# Altium schematic sheet Sheet.SchDoc
size A4; SheetNumber: 1; SheetTotal: 1
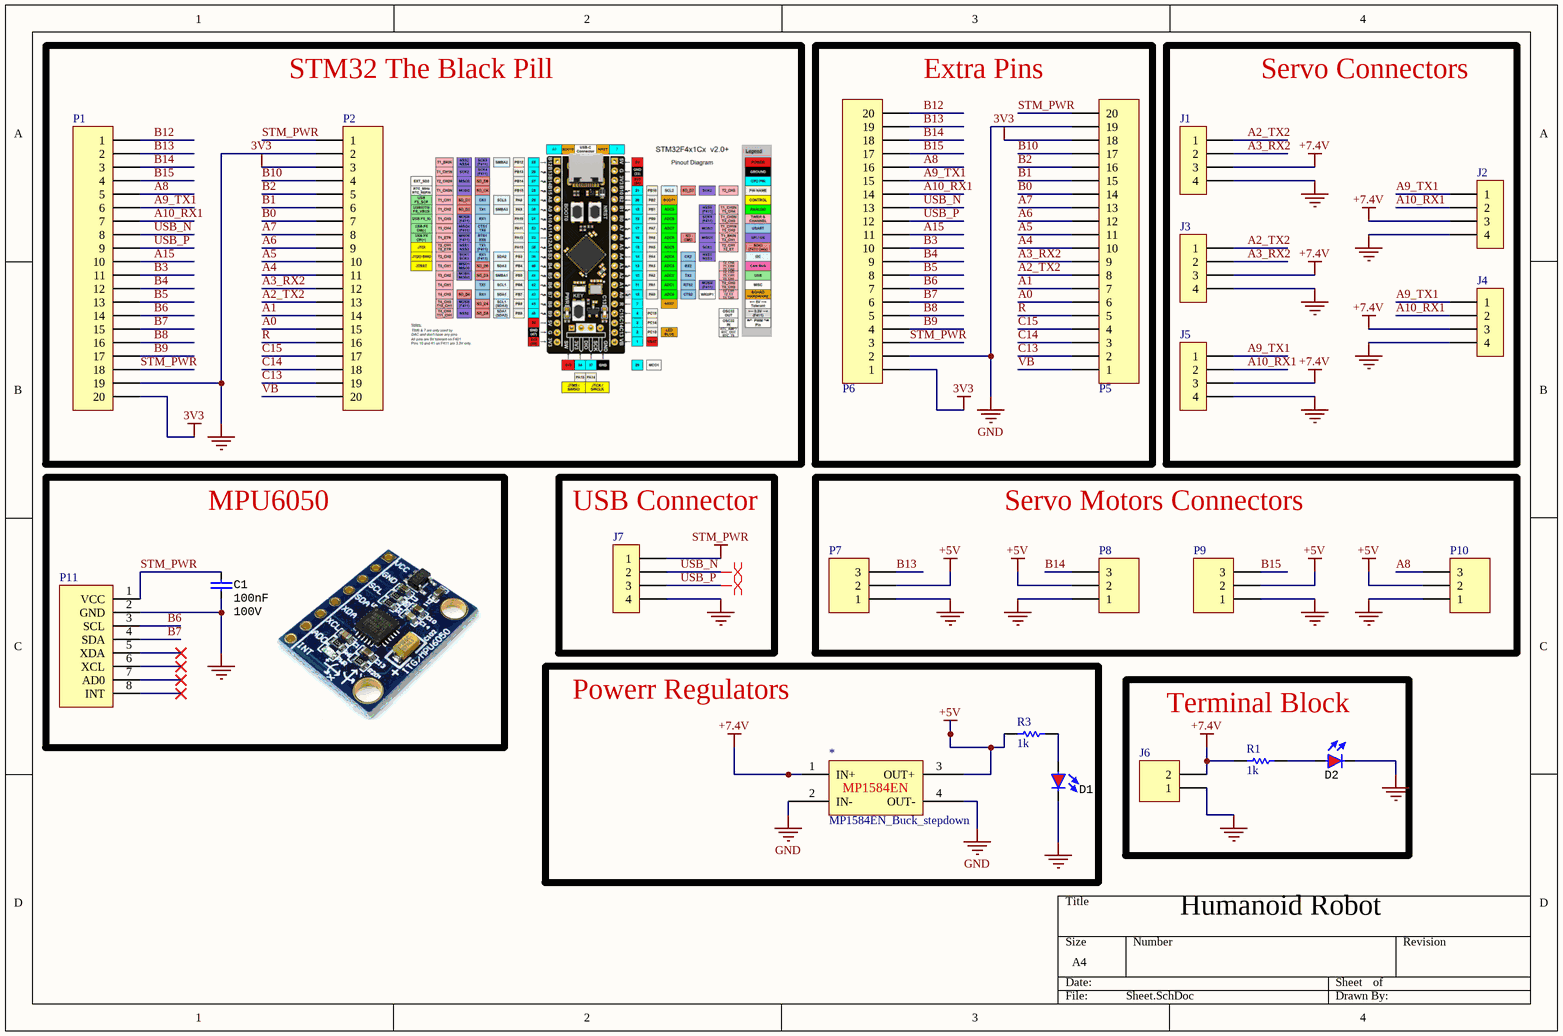
[diagram p0: Sheet.SchDoc]

## Parts
*  MP1584EN_Buck_stepdown  [MP1584EN_MODULE]
C1  value 100nF  Voltage: 100V  [CAP Ceramic SMD 0603]
D1  (no value)  [LED SMD 0805R]
D2  (no value)  [LED SMD 0805R]
J1  JST 4  [XH4/2.54mm/180]  (value not drawn)
J2  JST 4  [XH4/2.54mm/180]  (value not drawn)
J3  JST 4  [XH4/2.54mm/180]  (value not drawn)
J4  JST 4  [XH4/2.54mm/180]  (value not drawn)
J5  JST 4  [XH4/2.54mm/180]  (value not drawn)
J6  PWR IN  [Connector screw terminal Block TH 1x2 5.0]  (value not drawn)
J7  JST 4  [XH4/2.54mm/180]  (value not drawn)
P1  Connector Pinheader 1x20  [Header F 2.54X20]  (value not drawn)
P2  Connector Pinheader 1x20  [Header F 2.54X20]  (value not drawn)
P5  Connector Pinheader 1x20  [Header F 2.54X20]  (value not drawn)
P6  Connector Pinheader 1x20  [Header F 2.54X20]  (value not drawn)
P7  L_gripper  [Header 2.54X3]  (value not drawn)
P8  Connector Pinheader 1x3  [Header 2.54X3]  (value not drawn)
P9  R_gripper  [Header 2.54X3]  (value not drawn)
P10  Connector Pinheader 1x3  [Header 2.54X3]  (value not drawn)
P11  MPU6050 (GY-521 Module)  [MPU6050 (GY-521 Module)]  (value not drawn)
R1  value 1k  [RESC2013X70X40ML20T20]  (hidden comment: Resistor 1k +/-1% 0805 125 mW)
R3  value 1k  [RESC2013X70X40ML20T20]  (hidden comment: Resistor 1k +/-1% 0805 125 mW)

## Blocks framed on the sheet
STM32 The Black Pill: P1 P2
Extra Pins: P5 P6
Servo Connectors: J1-J5
MPU6050: C1 P11
USB Connector: J7
Servo Motors Connectors: P7-P10
Powerr Regulators: * D1 R3
Terminal Block: D2 J6 R1

## Nets
3V3: P1.20 P2.3 P5.18 P6.1
+5V: *.3(OUT+) P7.2 P8.2 P9.2 P10.2 R3.1
+7.4V: *.1(IN+) J1.3 J2.3 J3.3 J4.3 J5.3 J6.2 R1.1
GND: *.2(IN-) *.4(OUT-) C1.2 D1.2 D2.2 J1.4 J2.4 J3.4 J4.4 J5.4 J6.1 J7.4 P1.19 P2.2 P5.19 P6.2 P7.1 P8.1 P9.1 P10.1 P11.2(GND)
STM_PWR: C1.1 J7.1 P1.18 P2.1 P5.20 P6.3 P11.1(VCC)
A0: P2.15 P5.6
A1: P2.14 P5.7
A2_TX2: J1.1 J3.1 P2.13 P5.8
A3_RX2: J1.2 J3.2 P2.12 P5.9
A4: P2.11 P5.10
A5: P2.10 P5.11
A6: P2.9 P5.12
A7: P2.8 P5.13
A8: P1.5 P6.16 P10.3
A9_TX1: J2.1 J4.1 J5.1 P1.6 P6.15
A10_RX1: J2.2 J4.2 J5.2 P1.7 P6.14
A15: P1.10 P6.11
B0: P2.7 P5.14
B1: P2.6 P5.15
B2: P2.5 P5.16
B3: P1.11 P6.10
B4: P1.12 P6.9
B5: P1.13 P6.8
B6: P1.14 P6.7 P11.3(SCL)
B7: P1.15 P6.6 P11.4(SDA)
B8: P1.16 P6.5
B9: P1.17 P6.4
B10: P2.4 P5.17
B12: P1.1 P6.20
B13: P1.2 P6.19 P7.3
B14: P1.3 P6.18 P8.3
B15: P1.4 P6.17 P9.3
C13: P2.19 P5.2
C14: P2.18 P5.3
C15: P2.17 P5.4
R: P2.16 P5.5
USB_N: J7.2 P1.8 P6.13
USB_P: J7.3 P1.9 P6.12
VB: P2.20 P5.1
NetD1_1: D1.1 R3.2
NetD2_1: D2.1 R1.2

Not connected (* = marked no-connect by the designer): P11 5(XDA)* 6(XCL)* 7(AD0)* 8(INT)*

## Layout directives
differential pair: USB_N, USB_P

## Notes on the sheet
- Humanoid Robot
- (in symbol MP1584EN_Buck_stepdown) MP1584EN

## Library data of the parts
C1 = CAP 0603 100nF 100V X7R 10%: 100V 100nF X7R ±10% 0603 Multilayer Ceramic Capacitors MLCC - SMD/SMT ROHS; Manufacturer: Yageo; Manufacturer Part Number: CC0603KRX7R0BB104; Supplier: LCSC; Supplier Part Number: C113803; Temperature Characteristics Code: X7R
D1 D2 = LED 0805 Red: red 0805 Light Emitting Diodes (LED) ROHS; Manufacturer: FOSHAN Nationstar Optoelectronics; Manufacturer Part Number: NCD0805R1; Supplier: LCSC; Supplier Part Number: C84256; RoHS: No; Category: Uncategorized; Stock 1: 1189900; Pricing 1: 50=0.01160, 500=0.00900, 3000=0.00780, 6000=0.00700, 24000=0.00660, 51000=0.00640 (USD)
J1-J5 J7 = JST 4: MaleHeader 4x1
J6 = connector screw terminal 1x2: 691214110002 - Wire-To-Board Terminal Block, 3.5 mm, 2 Positions, 24 AWG, 16 AWG, 1.5 mm², Screw; Manufacturer: Wurth Electronics; Plating: Brass,Steel; Number of Levels: 1; Number of Positions Per Level: 2; Current: 10A; Voltage: 300V; Wire Gauge (Max): 24AWG; Wire Gauge (Min): 16AWG; Pitch: 0.138inch; Stripping Length: -6mm; Supplier 1: Digi-Key; Manufacturer Part Number: 691214110002; RoHS: Yes; Category: Terminal Blocks; Stock 1: 5949; Pricing 1: 1=0.83000, 10=0.73900, 50=0.63800, 100=0.57100, 500=0.53800, 1400=0.50400 (USD); Mount: Through Hole; Color: Blue,Green; Housing Material: PA66; Contact Material: Brass; Contact Plating: Brass,Tin; Min Operating Temperature: -40°C; Max Operating Temperature: 105°C; Packaging: Bulk; Termination: Screw; Package Quantity: 1400; Number of Contacts: 2; Series: WR-TBL Series 2141; Voltage Rating: 300V; Current Rating: 10A; Length: 7.4mm; Width: 7.9mm; Height: 12.2mm; Wire/Cable Gauge: 24AWG; REACH SVHC: Unknown; RoHS Compliant: Yes; ComponentLink1URL: https://datasheet.ciiva.com/824/6912141100xx-824001.pdf?src-supplier=Digi-Key; ComponentLink1Description: https://datasheet.ciiva.com/824/6912141100xx-824001.pdf?src-supplier=Digi-Key; ComponentLink2URL: https://datasheet.ciiva.com/48693/001088618-da-01-en-wr-tbl-terminal-block2141-691214110002-48693195.pdf?src-supplier=Conrad; ComponentLink2Description: https://datasheet.ciiva.com/48693/001088618-da-01-en-wr-tbl-terminal-block2141-691214110002-48693195.pdf?src-supplier=Conrad; Supplier Part Number 1: 732-2747-ND
P1 P2 P5 P6 = Connector Pinheader 1x20: Header_20x1
P7-P10 = Connector Pinheader 1x3: Header_3x1
  P10: ComponentLink1Description: New link; ComponentLink1URL: *
R1 R3 = CMP-009-00010-5: Chip Resistor, 1 KOhm, +/- 1%, 0.125 W, -55 to 155 degC, 0805 (2013 Metric); Power: 125mW; Voltage Rating: 150V; Tolerance: 1%; RoHS Compliant: True; Mounting Technology: SM; Pins: 2; Case/Package: 0805; Max Operating Temperature: 155°C; Min Operating Temperature: -55°C